# EAGLE design Canzasi-Wrtr (EAGLE 7.6.0)
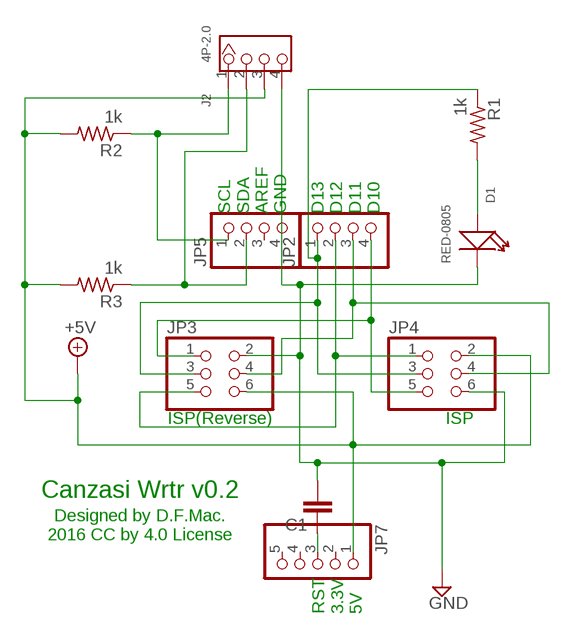
[diagram p0: schematic, sheet 1]

## Parts
C1  C-EUC0805  [C0805]
D1  RED-0805  SMD-LED-CLEAR-RED(0805)  [LED-0805]
J2  4P-2.0  GROVE-CONNECTOR-DIP(4P-2.0)  [HW4-2.0]
JP2  PINHD-1X4  [1X04]
JP3  PINHD-2X3  [2X03]
JP4  PINHD-2X3  [2X03]
JP5  PINHD-1X4  [1X04]
JP7  PINHD-1X5  [1X05]
R1  1k  R-US_R0603  [R0603]
R2  1k  R-US_R0603  [R0603]
R3  1k  R-US_R0603  [R0603]

## Nets
+5V: J2.3 JP3.6 JP4.2 JP7.1 R2.2 R3.2
GND: C1.2 D1.- J2.4 JP3.2 JP4.6 JP5.4
N$1: JP2.4 JP3.1 JP4.5
N$2: C1.1 JP7.3
N$3: J2.1 JP5.1 R2.1
N$4: JP2.1 JP3.3 JP4.3 R1.1
N$5: JP2.2 JP3.5 JP4.1
N$6: JP2.3 JP3.4 JP4.4
N$7: J2.2 JP5.2 R3.1
N$8: D1.+ R1.2
Unconnected: JP5.3 JP7.2 JP7.4 JP7.5

## Notes on the sheet
- SCL
  SDA
  AREF
  GND
  
  D13
  D12
  D11
  D10
- ISP(Reverse) | ISP
- Canzasi Wrtr v0.2
- Designed by D.F.Mac.
  2016 CC by 4.0 License
- RST
  3.3V
  5V

## Library data of the parts
C1 = 0my:C-EU: CAPACITOR, European symbol
D1 = Seeed-OPL-Diode:SMD-LED-CLEAR-RED(0805): 304090046; MPN: 17-215SURC/S530-A2/TR8
J2 = Seeed-OPL-Connector:GROVE-CONNECTOR-DIP(4P-2.0): 320110033
JP2 JP5 = 0my:PINHD-1X4: PIN HEADER
JP3 JP4 = 0my:PINHD-2X3: PIN HEADER
JP7 = 0my:PINHD-1X5: PIN HEADER
R1-R3 = 0my:R-US_: RESISTOR, American symbol

## Net classes
0 default: width 0.33 mm, drill 0.178 mm, clearance 0.152 mm
1 VCC: width 0.508 mm, drill 0.178 mm, clearance 0.152 mm
2 GND: width 0.508 mm, drill 0.178 mm, clearance 0.152 mm

## Board
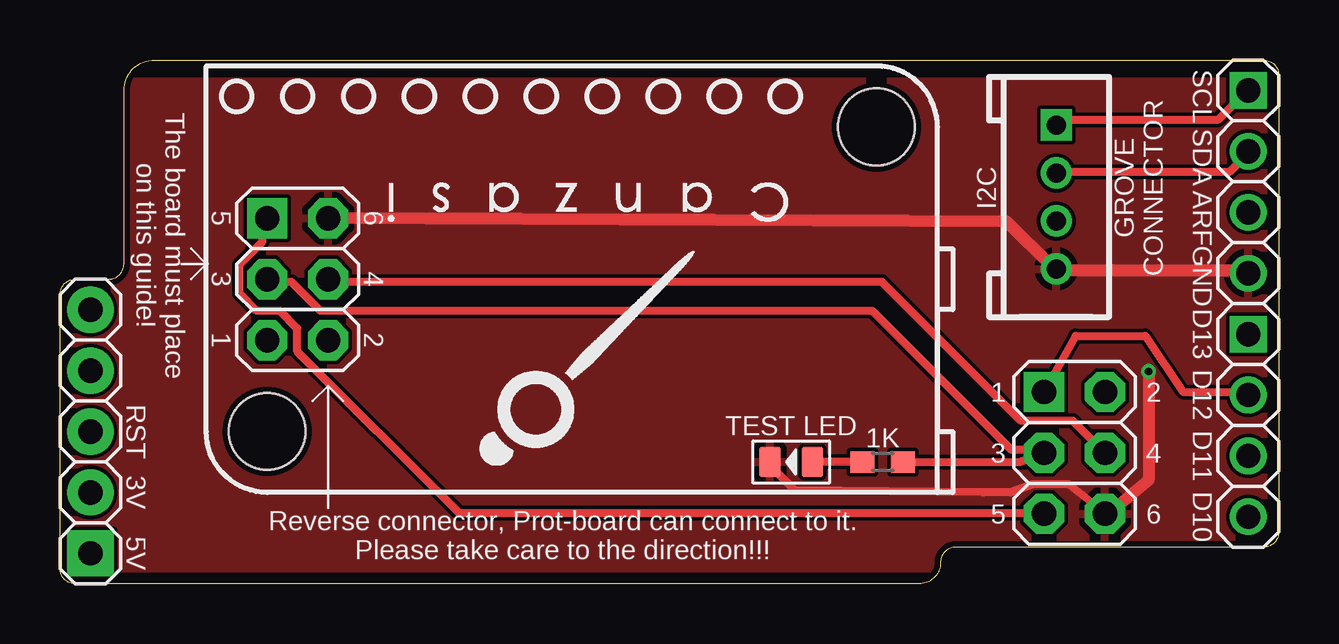
[diagram p1: board, top side]
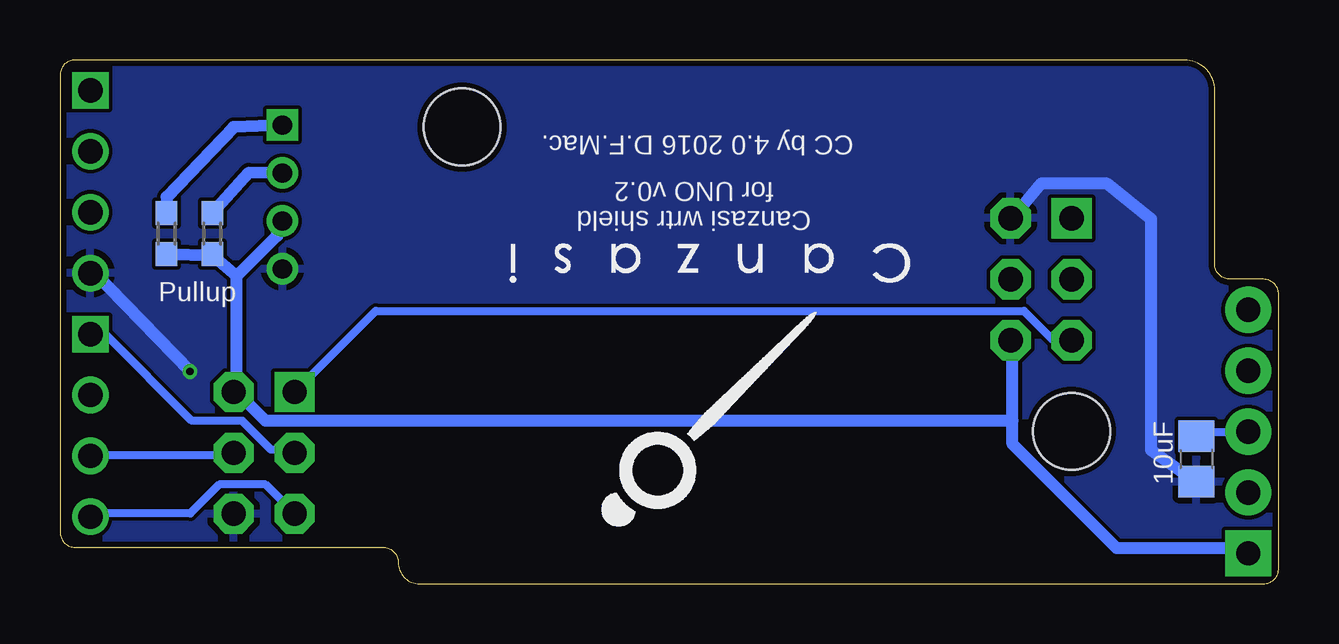
[diagram p2: board, bottom side, seen from below]

Size 50.8 x 21.84 mm. Coordinates in mm from the lower left corner, seen from the top.
Outline: 36.7,0.89 arc-90 35.81,0 0.64,0 arc-90 0,0.64 0,12.06 arc-90 0.64,12.7 2.03,12.7 arc90 2.67,13.34 2.67,20.57 arc-90 3.94,21.84 50.16,21.84 arc-90 50.8,21.21 50.8,2.16 arc-90 50.16,1.52 37.34,1.52 arc90 36.7,0.89
Copper layers (1*16): Top 0.035mm / dielectric 1.5mm / Bottom 0.035mm
Design rules "Elecrow_2-layer_eagle_rule": minimum track width 6mil, minimum drill 12mil, track to track 6mil, track to pad 6mil, pad to pad 6mil, via to via 6mil, smd to smd 0mil, copper to edge 10mil, drill to drill 10mil, minimum pad ring 10mil, minimum via ring 6mil, stop-mask expansion 2mil, vias tented up to drill 100mil, thermal gap 10mil
Holes 3.2 mm at 34.04,19.05 8.64,6.35

### Footprints (pad centres in the part's own frame; a part is rotated, then mirrored left to right if it is on the bottom)
C0805 = smd 1.3 x 1.5: 1 -0.95,0; 2 0.95,0
LED-0805 = smd 0.889 x 1.27: + -0.889,0; - 0.889,0
HW4-2.0 = drill 0.8 pad 1.27 square: 1 -3,0 | drill 0.8 pad 1.27: 2 -1,0; 3 1,0; 4 3,0
1X04 = drill 1.016 square: 1 -3.81,0 | drill 1.016: 2 -1.27,0; 3 1.27,0; 4 3.81,0
2X03 = drill 1.016 pad 1.676 square: 1 -2.54,-1.27 | drill 1.016 pad 1.676 octagon: 2 -2.54,1.27; 3 0,-1.27; 4 0,1.27; 5 2.54,-1.27; 6 2.54,1.27
1X05 = drill 1.016 pad 1.93 square: 1 -5.08,0 | drill 1.016 pad 1.93: 2 -2.54,0; 3 0,0; 4 2.54,0; 5 5.08,0
R0603 = smd 1 x 0.9: 1 -0.85,0; 2 0.85,0

### Placement (x,y rotation side)
C1  3.43,5.21 270 bottom
D1  30.48,5.08 180 top
J2  41.53,16.13 270 top
JP2  49.53,6.6 270 top
JP3  9.91,12.7 270 top
JP4  42.29,5.46 270 top
JP5  49.53,16.76 270 top
JP7  1.27,6.35 90 top
R1  34.29,5.08 180 top
R2  46.35,14.61 270 bottom
R3  44.45,14.61 270 bottom
U$1  CANZASI-LOGOMEDIUM  [CANZASI-LOGO-MEDIUM]  14.61,14.99 180 bottom
U$2  CANZASI-LOGOMEDIUM  [CANZASI-LOGO-MEDIUM]  31.11,17.53 180 top

### Tracks (layer width: path | path; a pad name or v marks a point on that pad's centre or on a via)
+5V
  Bottom 0.33: 11.1,9.93 JP3.6 | 1.45,1.49 JP7.1 | 43.43,8 JP4.2 | R3.2 R2.2
  Bottom 0.508: 43.43,12.83 41.74,14.52 41.74,15 J2.3 | 43.43,12.83 43.43,8 42.23,6.79 11.1,6.79 | 11.1,6.79 11.1,5.83 6.76,1.49 1.45,1.49 | 11.1,6.79 11.1,9.93 | R2.2 44.45,13.72 43.43,12.83
GND  (via drill 0.3)
  Top 0.33: 49.47,13.07 JP5.4 | JP4.6 43.67,2.93 43.67,3.01 43.66,2.87 42.06,4.14 40.55,4.15 39.62,3.81 38.48,3.81 30.64,3.9 29.68,4.86 D1.- | 41.38,13.18 J2.4
  Top 0.508: 49.47,13.07 41.74,13.07 J2.4 | 43.66,2.87 45.38,4.33 v45.38,8.85 | JP3.2 39.45,15.11 41.38,13.18
  Bottom 0.33: 3.62,4.38 C1.2 | 11.1,15.24 JP3.2 | 49.47,13.07 JP5.4
  Bottom 0.508: 3.62,4.38 5.32,5.58 5.32,15.21 7.19,16.7 9.89,16.7 11.1,15.24 | 49.47,13.07 v45.38,8.85
  pour Bottom: -0.64,22.23 51.44,22.23 51.44,0 -0.64,0
  pour Top: 0.64,0.64 0.64,20.95 50.16,20.95 50.16,0.64
N$1
  Top 0.33: JP3.1 8.45,15.24 8.45,14.28 7.48,13.31 7.48,12.1 8.2,11.38 9.17,11.38 9.89,10.65 9.89,9.69 16.65,2.93 41.02,2.93 JP4.5
  Bottom 0.33: JP2.4 49.47,2.93 45.36,2.93 44.16,4.14 42.23,4.14 41.02,2.93 JP4.5
N$2
  Bottom 0.33: C1.1 3.38,6.31 1.45,6.31 JP7.3
N$3
  Top 0.33: J2.1 41.74,19.34 48.26,19.34 49.47,20.55 JP5.1
  Bottom 0.508: J2.1 43.56,19.05 46.35,16.13 R2.1
N$4
  Top 0.33: JP3.3 8.69,12.59 9.65,12.59 10.86,11.38 33.86,11.38 39.65,5.59 41.02,5.59 JP4.3 40.01,5.08 R1.1
  Bottom 0.33: JP2.1 48.92,10.41 45.3,6.79 43.2,6.79 42,5.59 41.02,5.59 JP4.3
N$5
  Top 0.33: JP4.1 42.34,10.34 45.24,10.34 46.81,8 49.47,8 JP2.2
  Bottom 0.33: JP4.1 37.64,11.38 10.62,11.38 9.41,10.17 8.69,10.17 JP3.5
N$6
  Top 0.33: JP4.4 42.23,6.79 40.06,6.79 34.27,12.59 11.34,12.59 JP3.4
  Bottom 0.33: JP2.3 49.47,5.35 43.67,5.35 JP4.4
N$7
  Top 0.33: J2.2 41.74,17.17 48.74,17.17 49.47,17.89 JP5.2
  Bottom 0.508: J2.2 42.93,17.14 R3.1
N$8
  Top 0.33: R1.2 33.3,5.11 31.37,5.11 D1.+

### Text on the board
tNames: SCL | SDA | I2C | GROVE / CONNECTOR | 5 | 6 | ARF | The board must place / on this guide! | 3 | 4 | GND | 1 | 2 | D13 | 1 | 2 | D12 | TEST LED | RST | 1K | 3 | 4 | D11 | 3V | 5 | 6 | D10 | Reverse connector, Prot-board can connect to it. / Please take care to the direction!!! | 5V
bNames: CC by 4.0 2016 D.F.Mac. | Canzasi wrtr shield / for UNO v0.2 | Pullup | 10uF